# Altium project FreeWireBaseBoard.PrjPcb
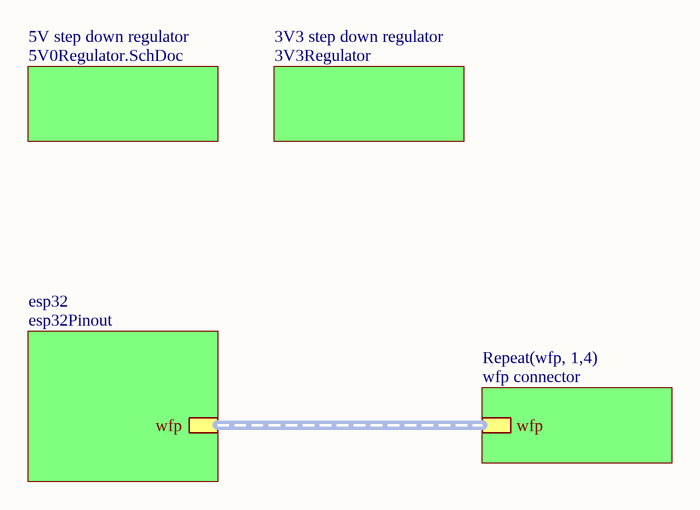
[diagram p0: TOP.SchDoc]
5 sheets, 19 parts. Net scope: hierarchical (ports join the sheet entries above them; power ports are global).
Sheets:
  TOP.SchDoc
    esp32 = esp32Pinout.SchDoc
    5V step down regulator = 5V0Regulator.SchDoc
    wfp1 = wfp connector.SchDoc
    wfp2 = wfp connector.SchDoc
    wfp3 = wfp connector.SchDoc
    wfp4 = wfp connector.SchDoc
    3V3 step down regulator = 3V3Regulator.SchDoc

## Sheet TOP.SchDoc
size A4; SheetNumber: 1; SheetTotal: 5

### Sub-sheets
3V3 step down regulator = 3V3Regulator: no entries
5V step down regulator = 5V0Regulator.SchDoc: no entries
esp32 = esp32Pinout: wfp (harness wfp)
Repeat(wfp, 1,4) = wfp connector: wfp

### Buses and harness runs
harness sheet esp32/wfp = sheet Repeat(wfp, 1,4)/wfp

## Sheet esp32Pinout.SchDoc
size A4; SheetNumber: 2; SheetTotal: 5
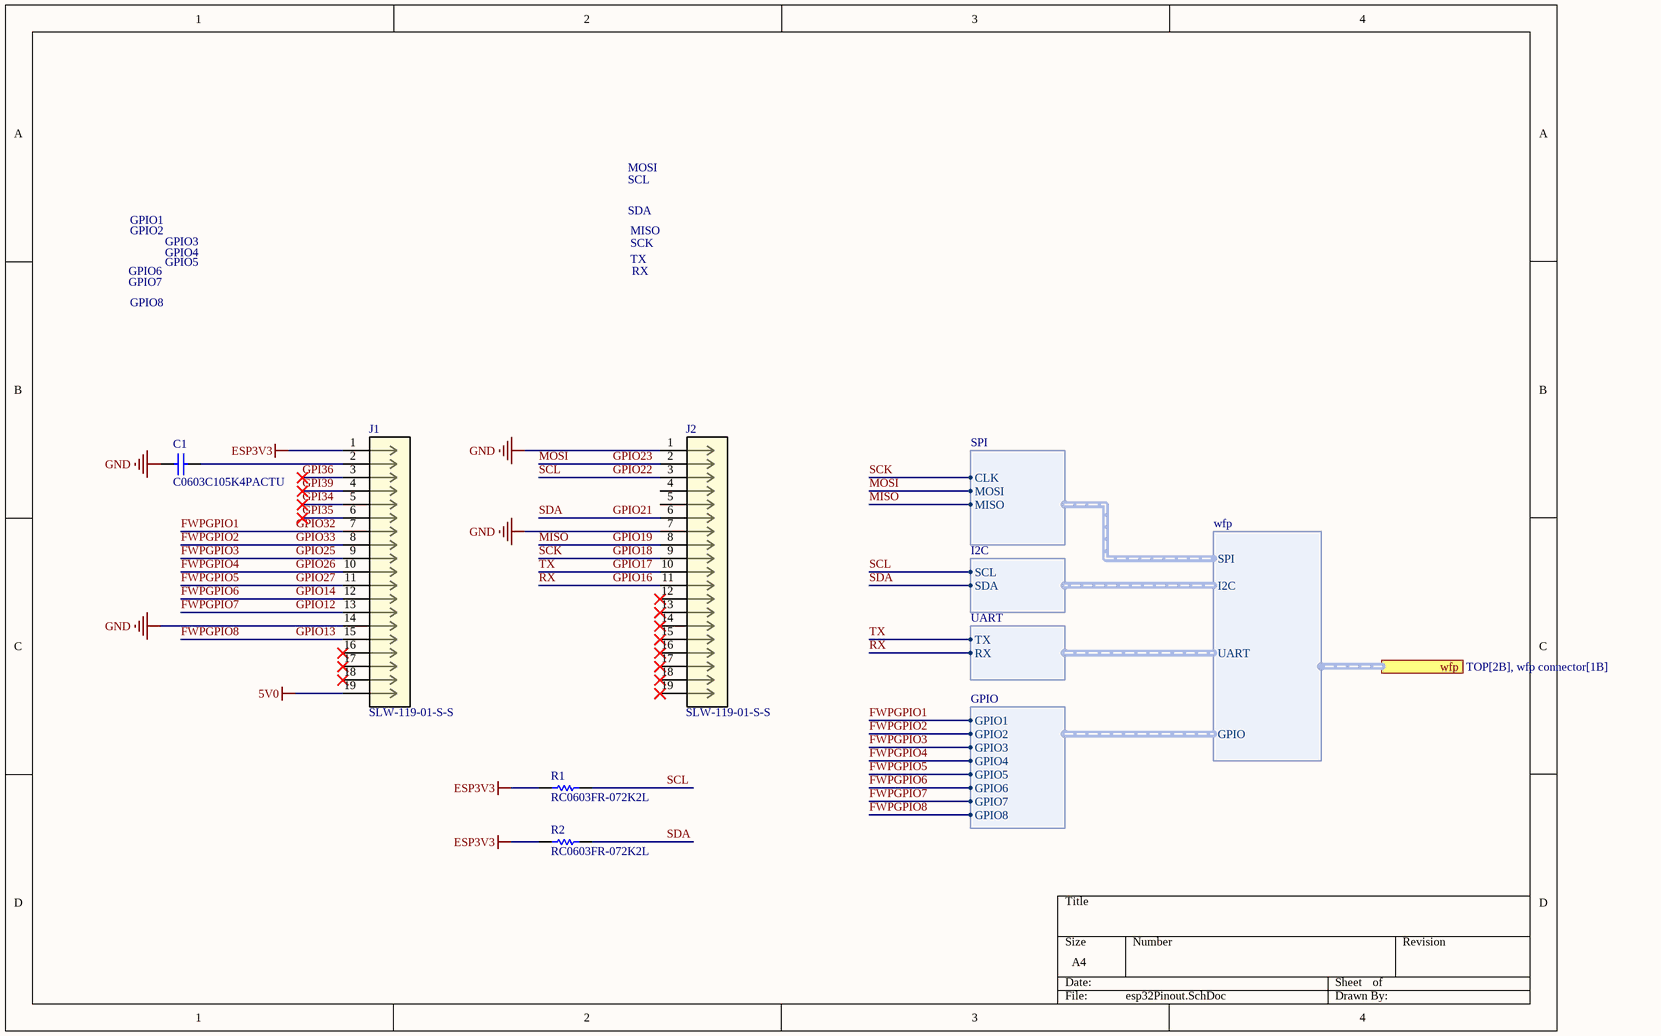
[diagram p1: esp32Pinout.SchDoc]

### Parts
C1  C0603C105K4PACTU  [CAPC1608X90X35NL15T15]
J1  SLW-119-01-S-S  [CON19_1X19_TU_SLW_SAI]
J2  SLW-119-01-S-S  [CON19_1X19_TU_SLW_SAI]
R1  RC0603FR-072K2L  [RESC1608X55X25LL10T15]
R2  RC0603FR-072K2L  [RESC1608X55X25LL10T15]

### Ports
wfp (harness wfp, see TOP[2B], wfp connector[1B])

### Harnesses
wfp: SPI, I2C, GPIO, UART
SPI: CLK, MOSI, MISO
I2C: SCL, SDA
UART: TX, RX
GPIO: GPIO1, GPIO2, GPIO3, GPIO4, GPIO5, GPIO6, GPIO7, GPIO8

### Nets
5V0: J1.19
ESP3V3: J1.1 R1.1 R2.1
GND: C1.1 J1.14 J2.1 J2.7
FWPGPIO1: J1.7 ; harness GPIO.GPIO1  [also labelled GPIO32]
FWPGPIO2: J1.8 ; harness GPIO.GPIO2  [also labelled GPIO33]
FWPGPIO3: J1.9 ; harness GPIO.GPIO3  [also labelled GPIO25]
FWPGPIO4: J1.10 ; harness GPIO.GPIO4  [also labelled GPIO26]
FWPGPIO5: J1.11 ; harness GPIO.GPIO5  [also labelled GPIO27]
FWPGPIO6: J1.12 ; harness GPIO.GPIO6  [also labelled GPIO14]
FWPGPIO7: J1.13 ; harness GPIO.GPIO7  [also labelled GPIO12]
FWPGPIO8: J1.15 ; harness GPIO.GPIO8  [also labelled GPIO13]
GPI34: J1.5
GPI35: J1.6
GPI36: J1.3
GPI39: J1.4
GPIO16: J2.11 ; harness UART.RX  [also labelled RX]
GPIO17: J2.10 ; harness UART.TX  [also labelled TX]
GPIO18: J2.9 ; harness SPI.CLK  [also labelled SCK]
GPIO19: J2.8 ; harness SPI.MISO  [also labelled MISO]
GPIO21: J2.6 R2.2 ; harness I2C.SDA  [also labelled SDA]
GPIO22: J2.3 R1.2 ; harness I2C.SCL  [also labelled SCL]
GPIO23: J2.2 ; harness SPI.MOSI  [also labelled MOSI]
NetC1_2: C1.2 J1.2

Not connected (* = marked no-connect by the designer): J1 16* 17* 18*; J2 4 5 12* 13* 14* 15* 16* 17* 18* 19*

### Notes on the sheet
- MOSI
- GPIO1
- GPIO2
- GPIO3
- SCL
- SDA
- MISO
- SCK
- GPIO6
- GPIO7
- GPIO8
- GPIO4
- GPIO5
- TX
- RX

### Library data of the parts
C1 = CMP-2006-02239-1: Manufacturer: Kemet; Part Number: C0603C105K4PACTU
J1 J2 = SLW-119-01-S-S: No Description Available; Mfr_Name: Samtec Inc; RefDes: RefDes; Type: Type
R1 R2 = CMP-2000-06934-1: Thick Film Resistor, 2.2 KOhm, 100 mW, 50 V, +/- 1%, -55 to 155 degC, 2-Pin SMD (0603), RoHS, Tape and Reel; Manufacturer: Yageo; Resistance: 2.2kOhms; Temperature Coefficient: 100PPM/C; Voltage Rating: 50V; Power Rating: 100mW; Tolerance: 1%; Datasheet Version: Rev. 7, 05/2017; Case Code - mm: 1608; Series: RC; Mounting Technology: SurfaceMount; Package Description: 2-Pin Surface Mount Device, Body 1.6 x 0.8 mm; Case Code - in: 0603; Package Reference: 0603; Product: ThickFilmResistorsGeneralPurpose; Manufacturer URL: http://www.yageo.com/; Termination Style: SMD/SMT; Operating Temperature Range: -55Cto+155C; Datasheet URL: http://www.yageo.com/documents/recent/PYu-RC_Group_51_RoHS_L_7.pdf; Packaging: Reel

## Sheet 5V0Regulator.SchDoc
size A4; SheetNumber: 4; SheetTotal: 5
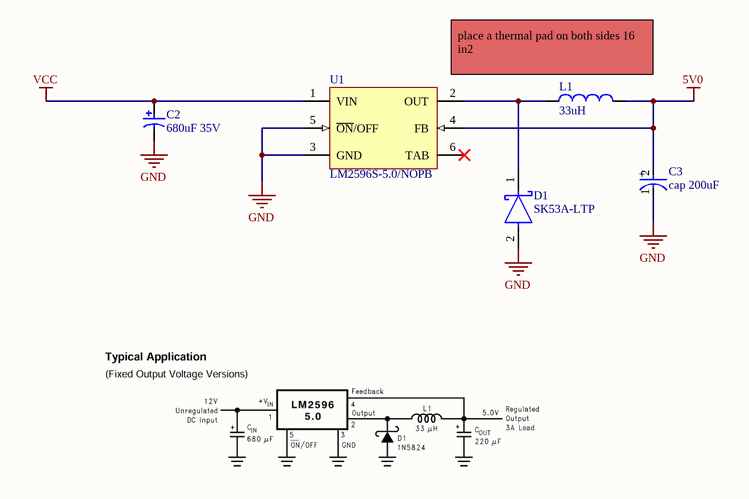
[diagram p2: 5V0Regulator.SchDoc]

### Parts
C2  680uF 35V  [NIC-CAPA2-10X10_V]
C3  cap 200uF  [CAPAE7262X77M]
D1  SK53A-LTP  [FP-DO-214AC-MFG]
L1  33uH  [INDM140130X52N]
U1  LM2596S-5.0/NOPB  [KTT0005B_M]

### Nets
5V0: C3.2(A) L1.2 U1.4(FB)
GND: C2.2 C3.1(C) D1.2(A) U1.3(GND) U1.5(~{ON}/OFF)
VCC: C2.1 U1.1(VIN)
NetD1_1: D1.1(C) L1.1 U1.2(OUT)

Not connected (* = marked no-connect by the designer): U1 6(TAB)*

### Notes on the sheet
- place a thermal pad on both sides 16 in2
- (in symbol cap 200uF) +

### Library data of the parts
C2 = CMP-0687-00001-1: Aluminum Electrolytic Capacitor, UD Series, Low Impedance, 680 uF, 10 V, + / - 20%, -55 to 105 degC, Chip Type, 10 x 10 mm D x L, Pb-Free, Reel; PartNumber: UUD1A681MNL1GS; Manufacturer: Nichicon; Tolerance Rated Capacitance: -20 to 20%; Rated Voltage: 10 V; Impedance: 0.09 Ohm; Rated Ripple Current (at 100kHz): 670 mA; Packing: Dia382mm Reel; Endurance Time: 5000 h; RoHS: TRUE; PackageDescription: 2-Pin Surface Mount Device, Diameter 10 mm, Height 10 mm, Pitch 8 mm; DatasheetVersion: 08/2012; PackageReference: CAPAE-D10H10; ComponentLink1URL: http://www.nichicon.co.jp/; Rated Capacitance: 680 uF; Mounting Technology: Surface Mount; ComponentLink1Description: Manufacturer URL; Length: 10 mm; ComponentLink3Description: Package Specification; ComponentLink2URL: http://products.nichicon.co.jp/en/pdf/XJA043/e-ud.pdf; ComponentLink2Description: Datasheet; Diameter: 10 mm; ComponentLink3URL: http://products.nichicon.co.jp/en/pdf/XJA043/e-ud.pdf
D1 = CMP-56206-000004-1: DIODE SCHOTTKY 5A 30V SMA; Mount: Surface Mount; Max Reverse Voltage (DC): 30V; Case/Package: SMA; Packaging: Tape and Reel; Average Rectified Current: 5A
L1 = ind 330uH: Supplier 1: LCSC; Supplier Part Number 1: C19268660
U1 = CMP-0069-00269-3: SIMPLE SWITCHER® Power Converter 150 KHz 3A Step-Down Voltage Regulator, 5-pin TO-263, Pb-Free; Manufacturer: Texas Instruments; PowerWise: N; PackageTopMarking: NSUZXYTTE#*LM2596S*-5.0 P+; ComponentLink1URL: http://www.ti.com/general/docs/lit/getliterature.tsp?genericPartNumber=LM2596&fileType=pdf; PackageDescription: TO-263, Molded, .400 x .390 x .180in, 5 Lead, .067in Pitch, Surface Mount; RoHS: Y; PinCount: 5; Code_JEDEC: MO-169-AB; ComponentLink1Description: Datasheet URL; PackageReference: KTT0005B; CompType: Switcher
C3 = cap 200uF: Supplier 1: LCSC; Supplier Part Number 1: C4747975

## Sheet wfp connector.SchDoc
size A4; SheetNumber: 3; SheetTotal: 5
Used 4 times, as channels wfp1, wfp2, wfp3, wfp4. Parts and nets are listed once, with the designators drawn on the sheet.
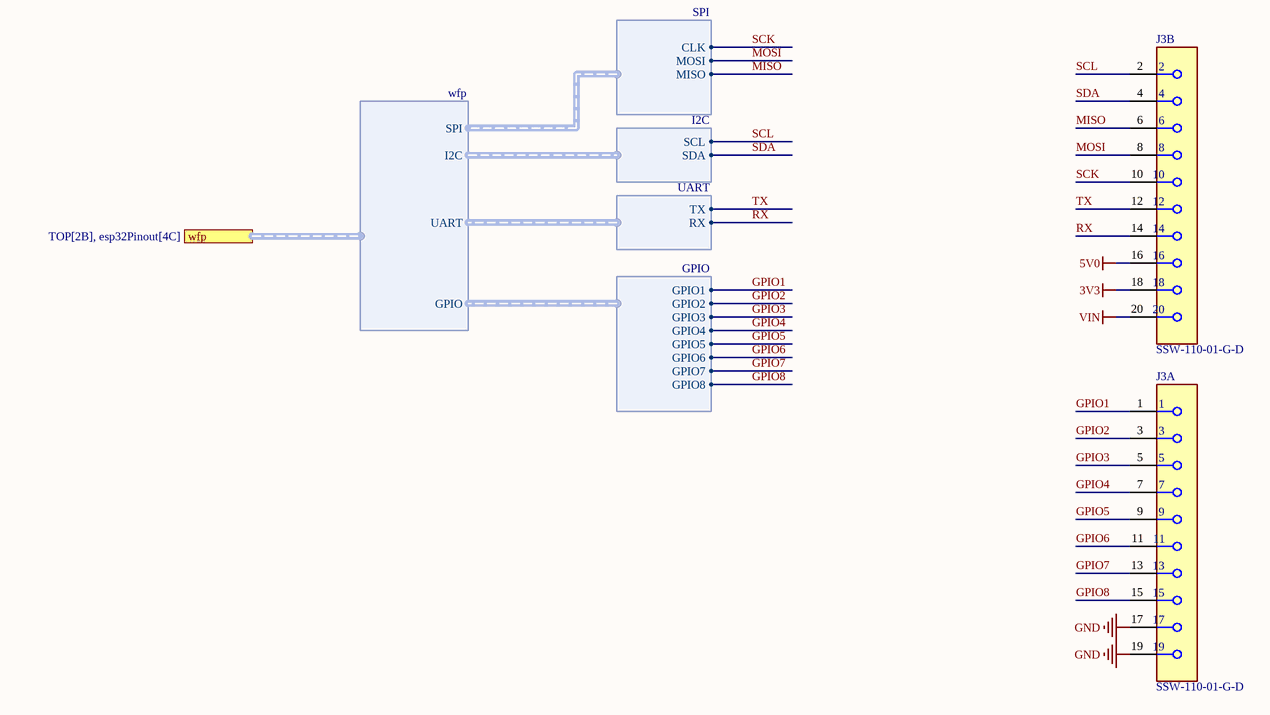
[diagram p3: wfp connector.SchDoc]

### Parts
J3  SSW-110-01-G-D  [FP-SSW-110-01-G-D-MFG]  (parts A,B of 2)

### Ports
wfp (harness wfp, see TOP[2B], esp32Pinout[4C])

### Harnesses
wfp: SPI, I2C, GPIO, UART
SPI: CLK, MOSI, MISO
I2C: SCL, SDA
UART: TX, RX
GPIO: GPIO1, GPIO2, GPIO3, GPIO4, GPIO5, GPIO6, GPIO7, GPIO8

### Nets
3V3: J3.18
5V0: J3.16
GND: J3.17 J3.19
VIN: J3.20
GPIO1: J3.1 ; harness GPIO.GPIO1
GPIO2: J3.3 ; harness GPIO.GPIO2
GPIO3: J3.5 ; harness GPIO.GPIO3
GPIO4: J3.7 ; harness GPIO.GPIO4
GPIO5: J3.9 ; harness GPIO.GPIO5
GPIO6: J3.11 ; harness GPIO.GPIO6
GPIO7: J3.13 ; harness GPIO.GPIO7
GPIO8: J3.15 ; harness GPIO.GPIO8
MISO: J3.6 ; harness SPI.MISO
MOSI: J3.8 ; harness SPI.MOSI
RX: J3.14 ; harness UART.RX
SCK: J3.10 ; harness SPI.CLK
SCL: J3.2 ; harness I2C.SCL
SDA: J3.4 ; harness I2C.SDA
TX: J3.12 ; harness UART.TX

### Channels
wfp1: designators end in _wfp1
wfp2: designators end in _wfp2
wfp3: designators end in _wfp3
wfp4: designators end in _wfp4

### Library data of the parts
J3 = CMP-02766-000052-2: CONN RCPT 20POS 0.1 GOLD PCB; Max Voltage Rating (AC): 550V; Connector Type: Receptacle; Pitch: 2.54mm; Row Spacing: 0.1inch; Number of Positions: 20; Mating Cycles: 100; Contact Resistance: 10mR; Current Rating: 6.9A; Mount: Through Hole; REACH SVHC: No SVHC; Max Operating Temperature: 125°C; Radiation Hardening: No; Series: SSW; RoHS Compliant: Yes; Housing Color: Black; Min Operating Temperature: -55°C; Lead Free: Lead Free; Voltage Rating: 550V; Contact Plating: Gold; Lead Pitch: 2.54mm; Color: Black; Housing Material: Polymer; Length: 25.91mm; Termination: Solder; Contact Material: Bronze; Orientation: Straight; Gender: Receptacle; Number of Contacts: 20; Depth: 4.95mm; Max Current Rating: 6.9A; Packaging: Bulk; Number of Rows: 2; Contact Type: Female Socket

## Sheet 3V3Regulator.SchDoc
size A4; SheetNumber: 5; SheetTotal: 5
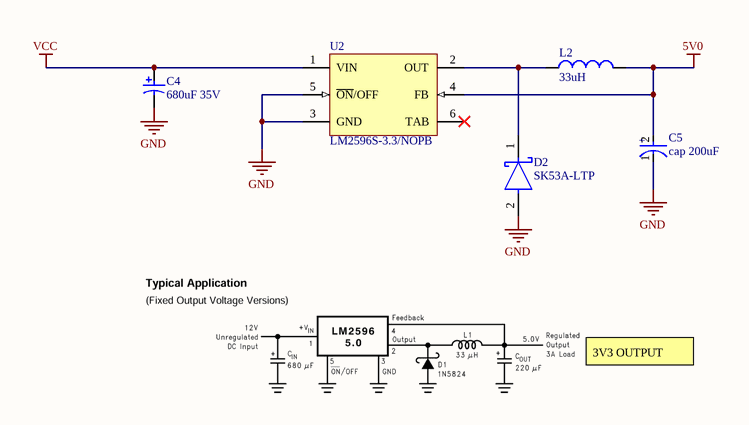
[diagram p4: 3V3Regulator.SchDoc]

### Parts
C4  680uF 35V  [NIC-CAPA2-10X10_V]
C5  cap 200uF  [CAPAE7262X77M]
D2  SK53A-LTP  [FP-DO-214AC-MFG]
L2  33uH  [INDM140130X52N]
U2  LM2596S-3.3/NOPB  [KTT0005B_M]

### Nets
5V0: C5.2(A) L2.2 U2.4(FB)
GND: C4.2 C5.1(C) D2.2(A) U2.3(GND) U2.5(~{ON}/OFF)
VCC: C4.1 U2.1(VIN)
NetD2_1: D2.1(C) L2.1 U2.2(OUT)

Not connected (* = marked no-connect by the designer): U2 6(TAB)*

### Notes on the sheet
- 3V3 OUTPUT
- (in symbol cap 200uF) +

### Library data of the parts
C4 = CMP-0687-00001-1: as C2 on sheet 5V0Regulator; RoHS: TRUE; PackageDescription: 2-Pin Surface Mount Device, Diameter 10 mm, Height 10 mm, Pitch 8 mm; DatasheetVersion: 08/2012; PackageReference: CAPAE-D10H10; ComponentLink1URL: http://www.nichicon.co.jp/; Rated Capacitance: 680 uF; Mounting Technology: Surface Mount; ComponentLink1Description: Manufacturer URL; Length: 10 mm; ComponentLink3Description: Package Specification; ComponentLink2URL: http://products.nichicon.co.jp/en/pdf/XJA043/e-ud.pdf; ComponentLink2Description: Datasheet; Diameter: 10 mm; ComponentLink3URL: http://products.nichicon.co.jp/en/pdf/XJA043/e-ud.pdf
D2 = CMP-56206-000004-1: DIODE SCHOTTKY 5A 30V SMA; Mount: Surface Mount; Max Reverse Voltage (DC): 30V; Case/Package: SMA; Packaging: Tape and Reel; Average Rectified Current: 5A
L2 = ind 330uH: Supplier 1: LCSC; Supplier Part Number 1: C19268660
U2 = CMP-0069-00275-3: SIMPLE SWITCHER® Power Converter 150 KHz 3A Step-Down Voltage Regulator, 5-pin TO-263, Pb-Free; Manufacturer: Texas Instruments; PackageTopMarking: NSUZXYTTE#*LM2596S*-3.3 P+; PowerWise: N; RoHS: Y; PackageReference: KTT0005B; PackageDescription: TO-263, Molded, .400 x .390 x .180in, 5 Lead, .067in Pitch, Surface Mount; PinCount: 5; ComponentLink1Description: Datasheet URL; Code_JEDEC: MO-169-AB; ComponentLink1URL: http://www.ti.com/general/docs/lit/getliterature.tsp?genericPartNumber=LM2596&fileType=pdf; CompType: Switcher
C5 = cap 200uF: Supplier 1: LCSC; Supplier Part Number 1: C4747975

## Nets that join several sheets
3V3: wfp1 (J3_wfp1.18), wfp2 (J3_wfp2.18), wfp3 (J3_wfp3.18), wfp4 (J3_wfp4.18)
5V0: esp32Pinout (J1.19), 5V0Regulator (C3.2 L1.2 U1.4), wfp1 (J3_wfp1.16), wfp2 (J3_wfp2.16), wfp3 (J3_wfp3.16), wfp4 (J3_wfp4.16), 3V3Regulator (C5.2 L2.2 U2.4)
GND: esp32Pinout (C1.1 J1.14 J2.1 J2.7), 5V0Regulator (5 pins), wfp1 (J3_wfp1.17 J3_wfp1.19), wfp2 (J3_wfp2.17 J3_wfp2.19), wfp3 (J3_wfp3.17 J3_wfp3.19), wfp4 (J3_wfp4.17 J3_wfp4.19), 3V3Regulator (5 pins)
VCC: 5V0Regulator (C2.1 U1.1), 3V3Regulator (C4.1 U2.1)
VIN: wfp1 (J3_wfp1.20), wfp2 (J3_wfp2.20), wfp3 (J3_wfp3.20), wfp4 (J3_wfp4.20)
FWPGPIO1: esp32Pinout (J1.7), wfp1 (J3_wfp1.1), wfp2 (J3_wfp2.1), wfp3 (J3_wfp3.1), wfp4 (J3_wfp4.1)
FWPGPIO2: esp32Pinout (J1.8), wfp1 (J3_wfp1.3), wfp2 (J3_wfp2.3), wfp3 (J3_wfp3.3), wfp4 (J3_wfp4.3)
FWPGPIO3: esp32Pinout (J1.9), wfp1 (J3_wfp1.5), wfp2 (J3_wfp2.5), wfp3 (J3_wfp3.5), wfp4 (J3_wfp4.5)
FWPGPIO4: esp32Pinout (J1.10), wfp1 (J3_wfp1.7), wfp2 (J3_wfp2.7), wfp3 (J3_wfp3.7), wfp4 (J3_wfp4.7)
FWPGPIO5: esp32Pinout (J1.11), wfp1 (J3_wfp1.9), wfp2 (J3_wfp2.9), wfp3 (J3_wfp3.9), wfp4 (J3_wfp4.9)
FWPGPIO6: esp32Pinout (J1.12), wfp1 (J3_wfp1.11), wfp2 (J3_wfp2.11), wfp3 (J3_wfp3.11), wfp4 (J3_wfp4.11)
FWPGPIO7: esp32Pinout (J1.13), wfp1 (J3_wfp1.13), wfp2 (J3_wfp2.13), wfp3 (J3_wfp3.13), wfp4 (J3_wfp4.13)
FWPGPIO8: esp32Pinout (J1.15), wfp1 (J3_wfp1.15), wfp2 (J3_wfp2.15), wfp3 (J3_wfp3.15), wfp4 (J3_wfp4.15)
GPIO16: esp32Pinout (J2.11), wfp1 (J3_wfp1.14), wfp2 (J3_wfp2.14), wfp3 (J3_wfp3.14), wfp4 (J3_wfp4.14)
GPIO17: esp32Pinout (J2.10), wfp1 (J3_wfp1.12), wfp2 (J3_wfp2.12), wfp3 (J3_wfp3.12), wfp4 (J3_wfp4.12)
GPIO18: esp32Pinout (J2.9), wfp1 (J3_wfp1.10), wfp2 (J3_wfp2.10), wfp3 (J3_wfp3.10), wfp4 (J3_wfp4.10)
GPIO19: esp32Pinout (J2.8), wfp1 (J3_wfp1.6), wfp2 (J3_wfp2.6), wfp3 (J3_wfp3.6), wfp4 (J3_wfp4.6)
GPIO21: esp32Pinout (J2.6 R2.2), wfp1 (J3_wfp1.4), wfp2 (J3_wfp2.4), wfp3 (J3_wfp3.4), wfp4 (J3_wfp4.4)
GPIO22: esp32Pinout (J2.3 R1.2), wfp1 (J3_wfp1.2), wfp2 (J3_wfp2.2), wfp3 (J3_wfp3.2), wfp4 (J3_wfp4.2)
GPIO23: esp32Pinout (J2.2), wfp1 (J3_wfp1.8), wfp2 (J3_wfp2.8), wfp3 (J3_wfp3.8), wfp4 (J3_wfp4.8)